# EAGLE design audio_final_final_for_real (EAGLE 5.10)

## Sheet 1 of 3
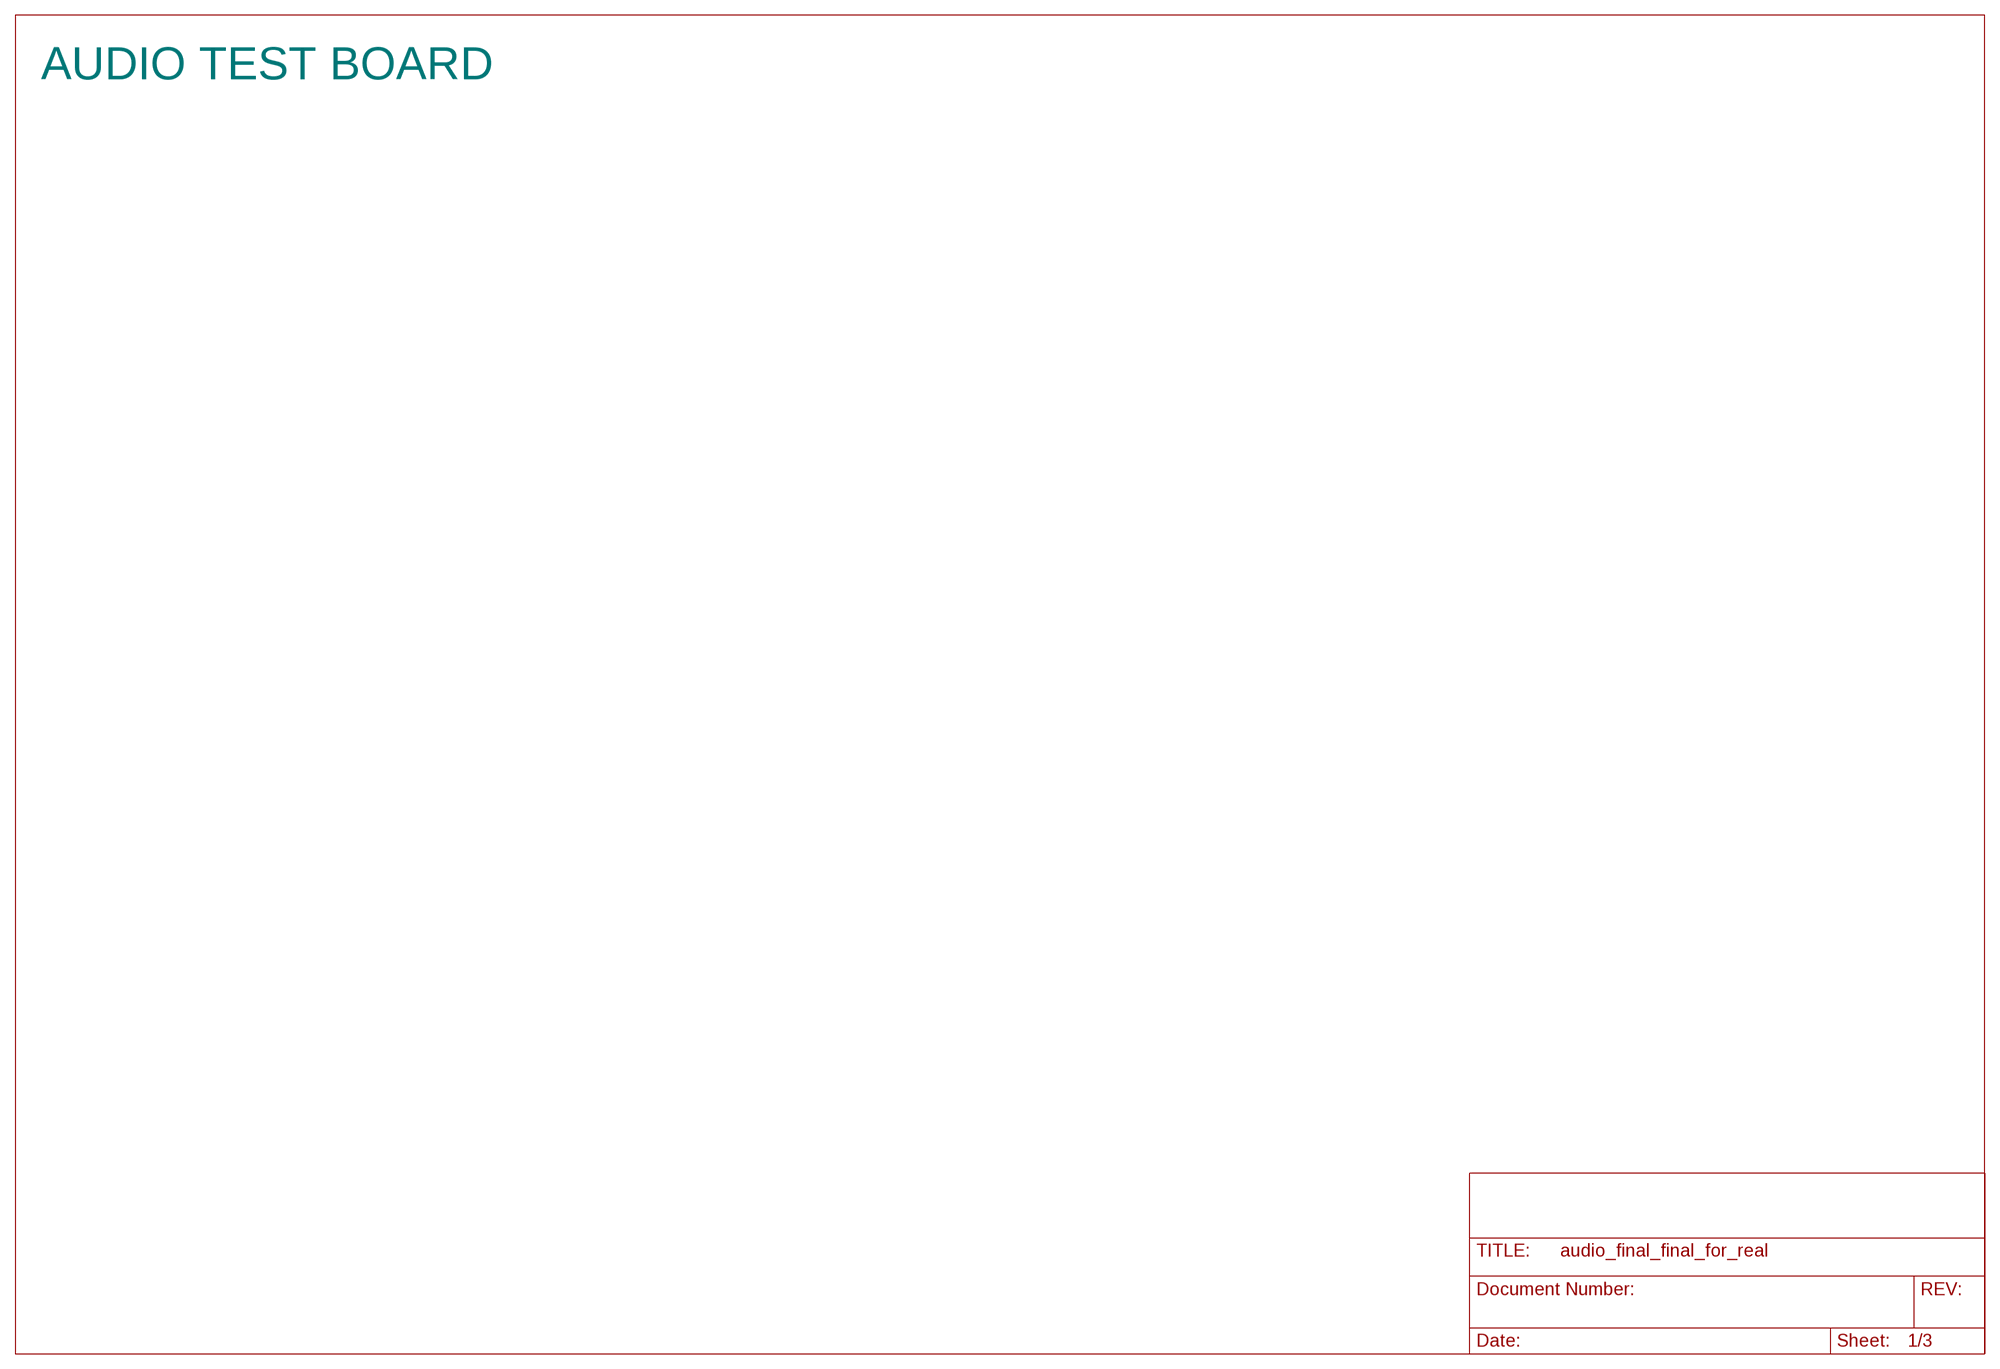
[diagram p0: schematic, sheet 1]

### Notes on the sheet
- AUDIO TEST BOARD

## Sheet 2 of 3
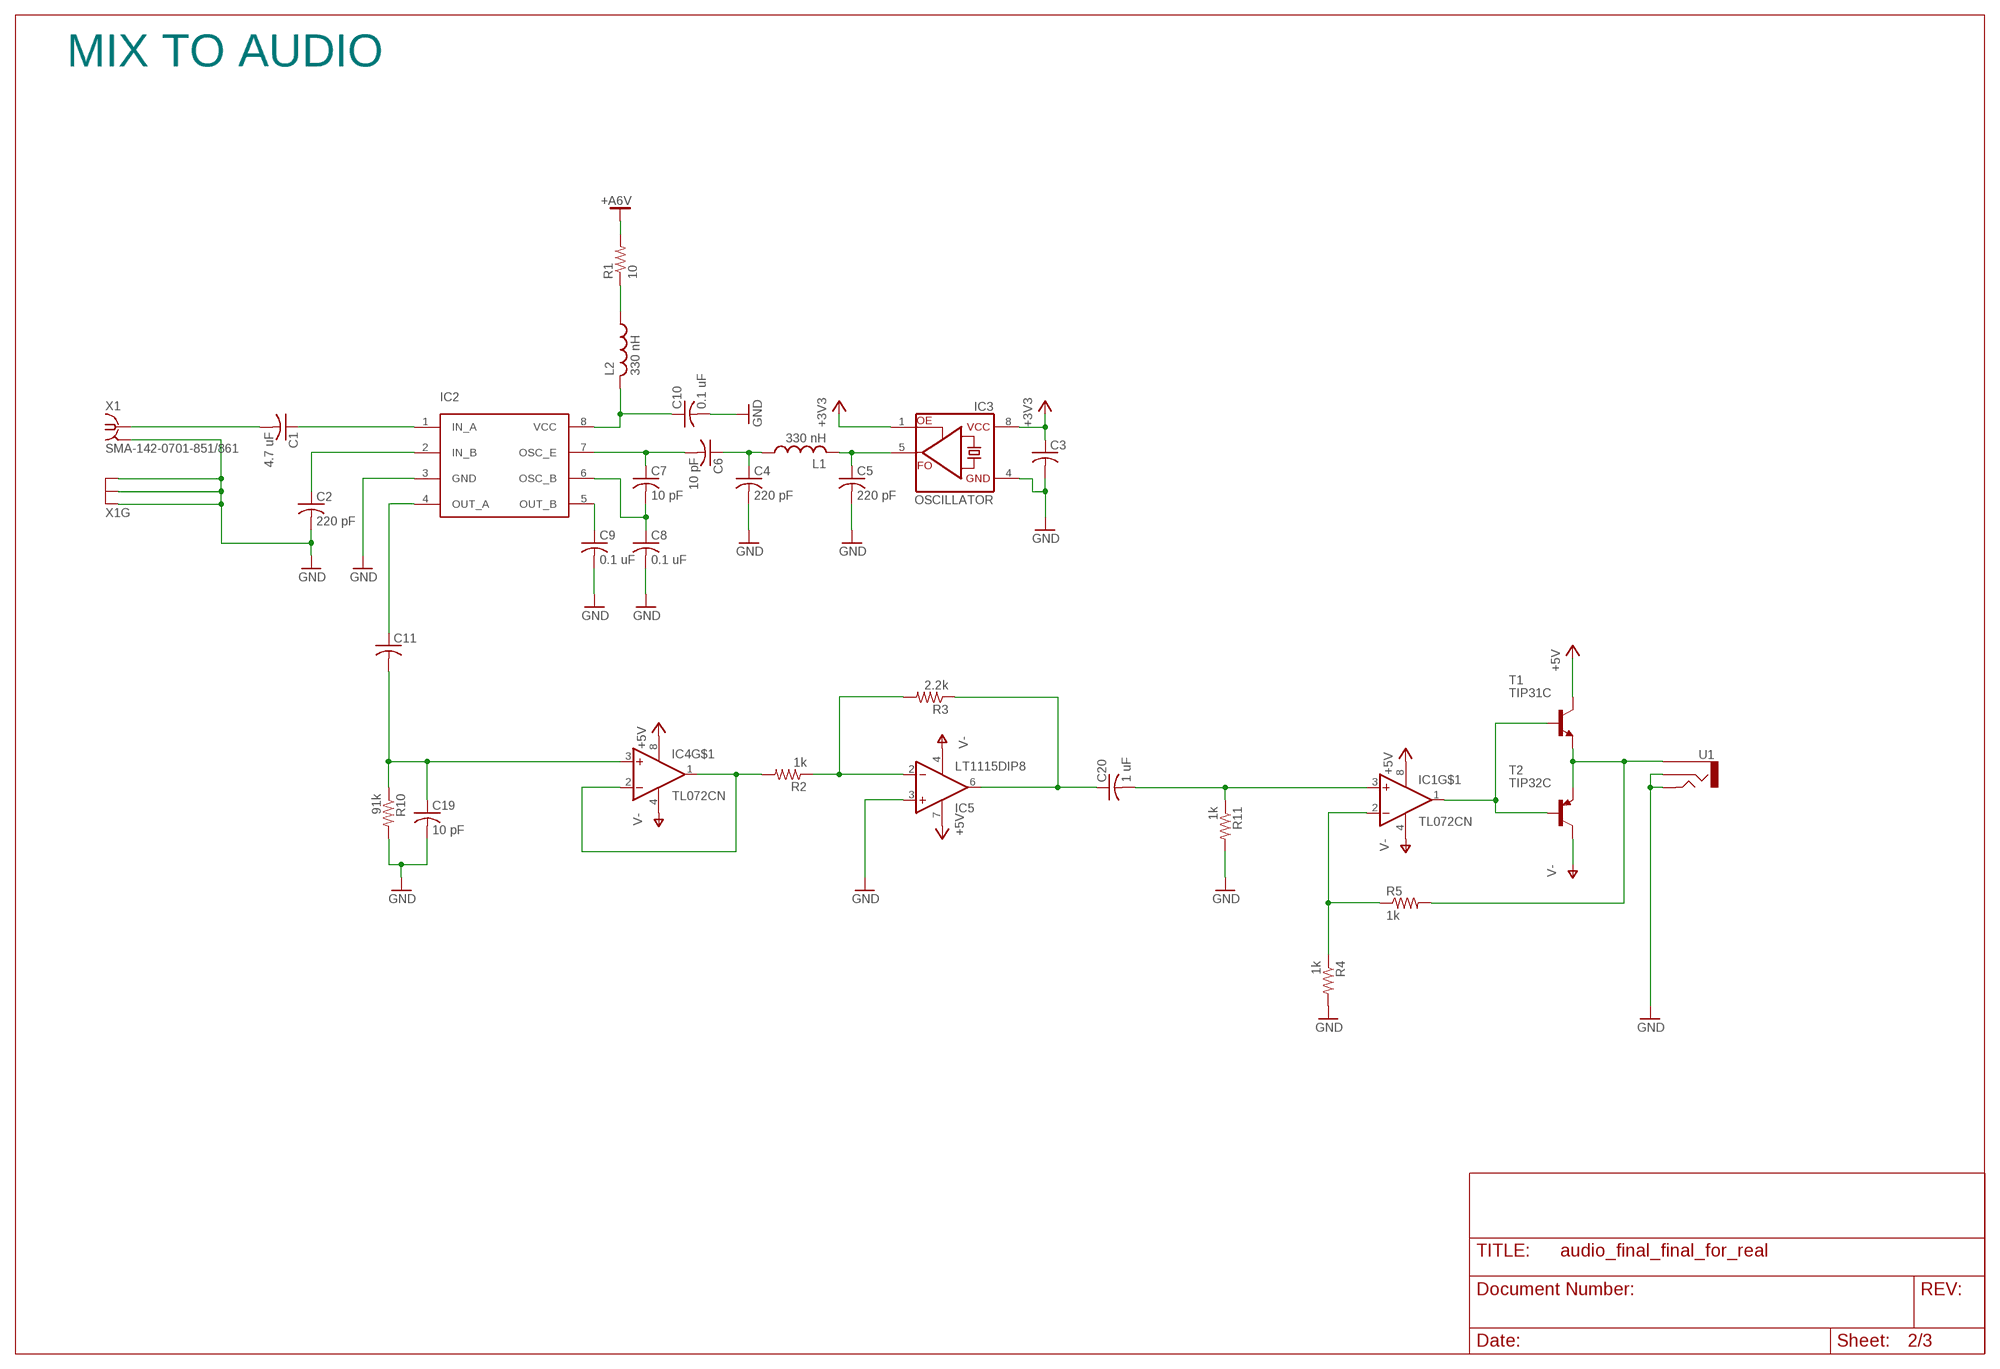
[diagram p1: schematic, sheet 2]

### Parts
C1  4.7 uF  C-US025-025X050  [C025-025X050]
C2  220 pF  C-US025-025X050  [C025-025X050]
C3  C-US025-025X050  [C025-025X050]
C4  220 pF  C-US025-025X050  [C025-025X050]
C5  220 pF  C-US025-025X050  [C025-025X050]
C6  10 pF  C-US025-025X050  [C025-025X050]
C7  10 pF  C-US025-025X050  [C025-025X050]
C8  0.1 uF  C-US025-025X050  [C025-025X050]
C9  0.1 uF  C-US025-025X050  [C025-025X050]
C10  0.1 uF  C-US025-025X050  [C025-025X050]
C11  C-US050-035X075  [C050-035X075]
C19  10 pF  C-US050-025X075  [C050-025X075]
C20  1 uF  C-US025-030X050  [C025-030X050]
IC1  TL072CN  [DIL08]
IC2  SA602DIP8  [DIL08]
IC3  OSCILLATOR  [DIL08]
IC4  TL072CN  [DIL08]
IC5  LT1115DIP8  [DIL08]
L1  330 nH  L-US132-17L  [132-17L]
L2  330 nH  L-US132-17L  [132-17L]
R1  10  R-US_0204/2V  [0204V]
R2  1k  R-US_0204/5  [0204/5]
R3  2.2k  R-US_0204/5  [0204/5]
R4  1k  R-US_0204/2V  [0204V]
R5  1k  R-US_0204/5  [0204/5]
R10  91k  R-US_0204/5  [0204/5]
R11  1k  R-US_0204/2V  [0204V]
T1  TIP31C  [TO220]
T2  TIP32C  [TO220]
U1  AUDIO-JACK2.5MM  [STEREOJACK2.5MM_STEREOJACK2.5MM]
X1  SMA-142-0701-851/861  [J502-ND-142-0701-851/861]

### Nets
+3V3: C3.1 IC3.1(OE) IC3.8(VCC) ; also sheet 3
+5V: IC1.8(V+) IC4.8(V+) IC5.7(V+) T1.2(C) ; also sheet 3
+A6V: R1.2 ; also sheet 3
GND: C2.2 C3.2 C4.2 C5.2 C8.2 C9.2 C10.2 C19.2 IC2.3(GND) IC3.4(GND) IC5.3(+IN) R4.2 R10.2 R11.2 U1.SHIELD U1.TIP X1.G@1(GND) X1.G@2(GND) X1.G@3(GND) X1.G@4(GND) ; also sheet 3
IC4: IC4.1(OUT) IC4.2(-IN) R2.2
N$1: C1.1 IC2.1(IN_A)
N$2: C2.1 IC2.2(IN_B)
N$3: C1.2 X1.1
N$4: C6.2 C7.1 IC2.7(OSC_E)
N$5: C7.2 C8.1 IC2.6(OSC_B)
N$6: C5.1 IC3.5(FO) L1.P$2
N$7: C4.1 C6.1 L1.P$1
N$8: C9.1 IC2.5(OUT_B)
N$9: L2.P$1 R1.1
N$10: C11.2 C19.1 IC4.3(+IN) R10.1
N$11: C10.1 IC2.8(VCC) L2.P$2
N$12: C11.1 IC2.4(OUT_A)
N$13: IC5.2(-IN) R2.1 R3.2
N$15: C20.1 IC5.6(OUT) R3.1
N$16: IC1.1(OUT) T1.1(B) T2.1(B)
N$17: R5.2 T1.3(E) T2.3(E) U1.RING1
N$19: C20.2 IC1.3(+IN) R11.1
N$20: IC1.2(-IN) R4.1 R5.1
V-: IC1.4(GND) IC4.4(GND) IC5.4(GND) T2.2(C) ; also sheet 3
Unconnected: IC1.5(+IN) IC1.6(-IN) IC1.7(OUT) IC4.5(+IN) IC4.6(-IN) IC4.7(OUT)

### Notes on the sheet
- MIX TO AUDIO

## Sheet 3 of 3
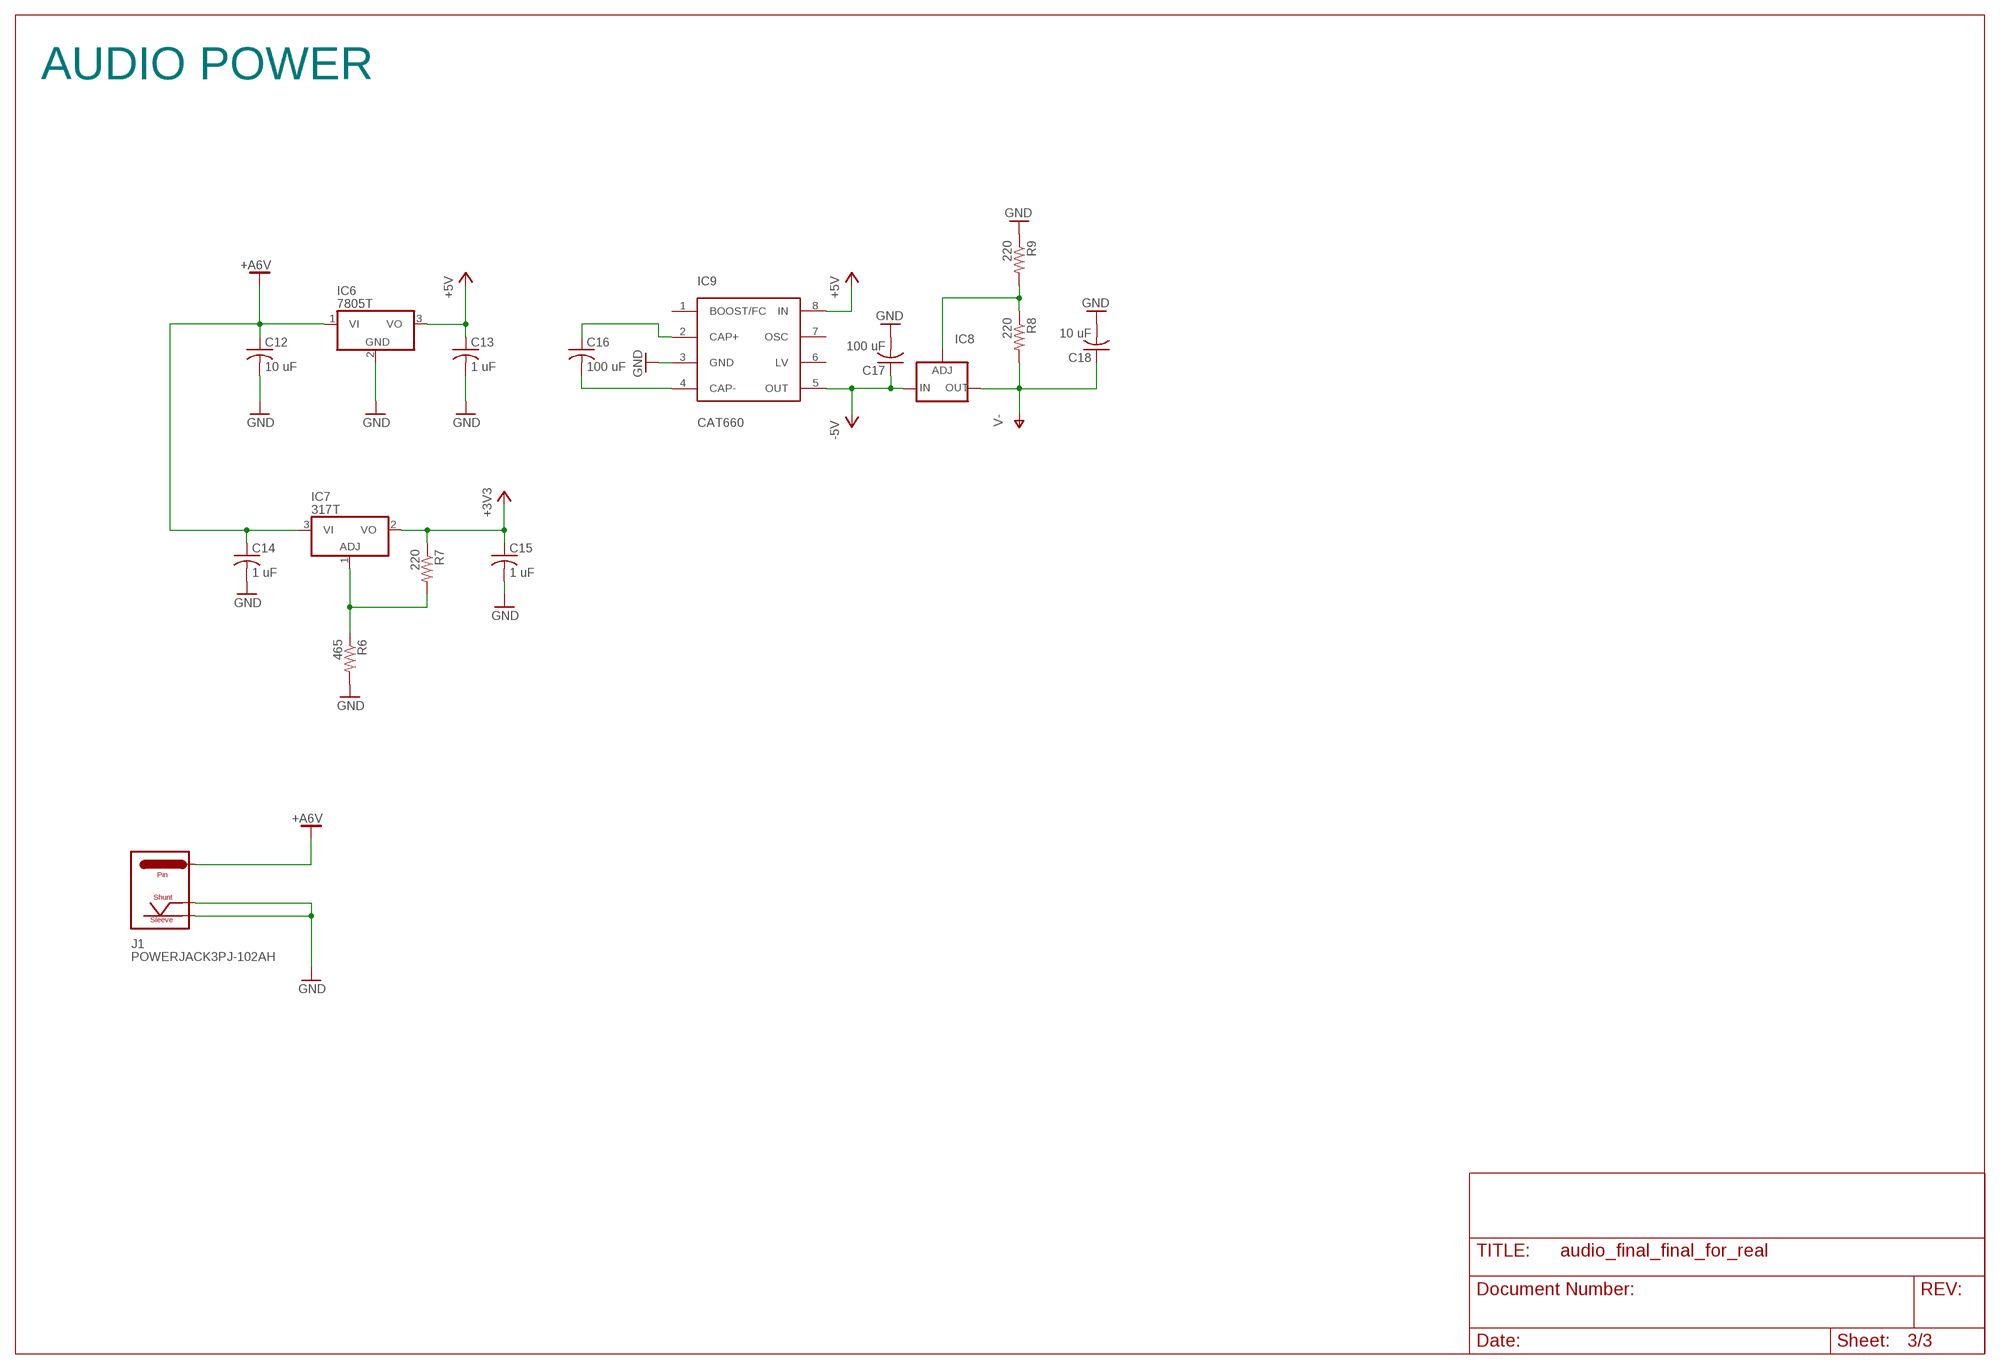
[diagram p2: schematic, sheet 3]

### Parts
C12  10 uF  C-US025-025X050  [C025-025X050]
C13  1 uF  C-US025-025X050  [C025-025X050]
C14  1 uF  C-US025-025X050  [C025-025X050]
C15  1 uF  C-US025-025X050  [C025-025X050]
C16  100 uF  C-US025-025X050  [C025-025X050]
C17  100 uF  C-US025-025X050  [C025-025X050]
C18  10 uF  C-US025-025X050  [C025-025X050]
IC6  7805T  [TO220H]
IC7  317T  [TO220H]
IC8  LM337TL  [337TL]
IC9  CAT660  [DIL08]
J1  POWERJACK3PJ-102AH  [PJ-102AH]
R6  465  R-US_0204/2V  [0204V]
R7  220  R-US_0204/2V  [0204V]
R8  220  R-US_0204/5  [0204/5]
R9  220  R-US_0204/2V  [0204V]

### Nets
+3V3: C15.1 IC7.2(VO) R7.1 ; also sheet 2
+5V: C13.1 IC6.3(VO) IC9.8(IN) ; also sheet 2
+A6V: C12.1 C14.1 IC6.1(VI) IC7.3(VI) J1.CENTER(PIN) ; also sheet 2
-5V: C17.1 IC8.2(IN) IC9.5(OUT)
GND: C12.2 C13.2 C14.2 C15.2 C17.2 C18.2 IC6.2(GND) IC9.3(GND) J1.SLEEVE J1.SWITCH(SHUNT) R6.2 R9.1 ; also sheet 2
N$14: C16.2 IC9.4(CAP-)
N$18: C16.1 IC9.2(CAP+)
N$21: IC7.1(ADJ) R6.1 R7.2
N$22: IC8.1(ADJ) R8.1 R9.2
V-: C18.1 IC8.3(OUT) R8.2 ; also sheet 2
Unconnected: IC9.1(BOOST/FC) IC9.6(LV) IC9.7(OSC)

### Notes on the sheet
- AUDIO POWER

## Library data of the parts
C1-C20 = rcl:C-US: CAPACITOR, American symbol
IC1 IC4 = senior_project_lib:TL072CN
IC2 = senior_project_lib:SA602
IC3 = senior_project_lib:OSCILLATOR
IC5 = senior_project_lib:LT1115
IC6 = linear:78*: Positive VOLTAGE REGULATOR Source: http://cache.national.com/ds/LM/LM78L05.pdf http://www.fairchildsemi.com/ds/LM/LM7805.pdf
IC7 = linear:*317: Positive VOLTAGE REGULATOR
IC8 = v-reg:LM337TL: VOLTAGE REGULATOR
IC9 = senior_project_lib:CAT660
J1 = ads4:POWERJACK3: Pin-Sleeve-Shunt Power Jack
L1 L2 = senior_project_lib:L-US: INDUCTOR, American symbol
R1-R11 = rcl:R-US_: RESISTOR, American symbol
T1 = transistor-neu-to92:TIP31C: NPN TRANSISTOR
T2 = transistor:TIP32: PNP Transistor Medium Power Linear Switching Applications Source: http://onsemi.com
U1 = senior_project_lib:AUDIO-JACK: 3.5mm Audio Jack Simple 3.5mm common PCB mount audio jack. SKU: PRT-08032
X1 = con-coax:SMA-: SMA 50 Ohm End Launch Jack Receptacle - Round Contact Johnson Components Source: www.johnsoncomponents.com .. J502-ND.pdf

## Board
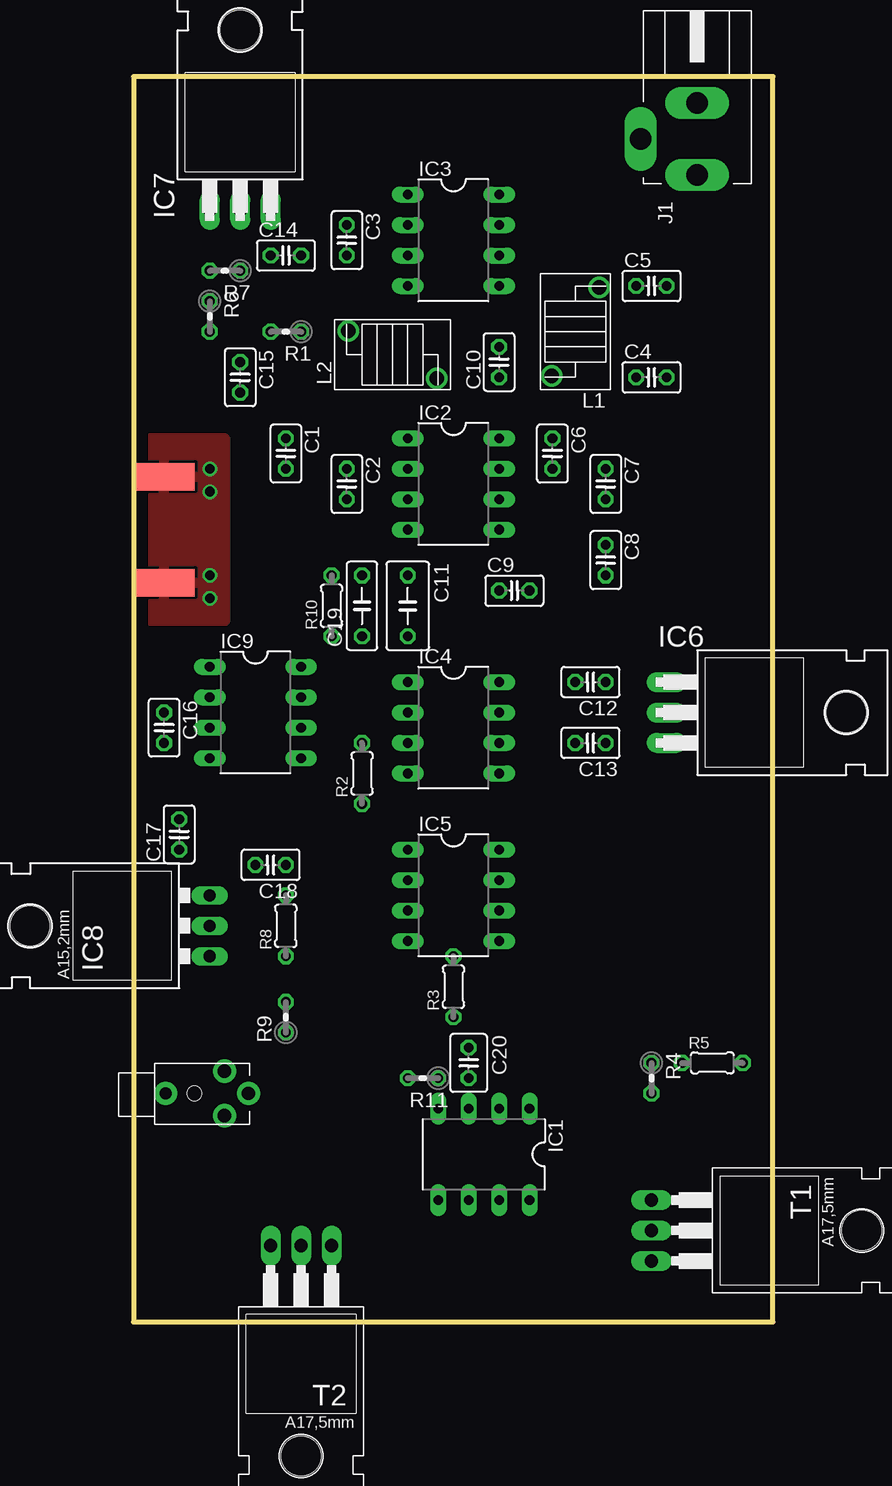
[diagram p3: board, top side]
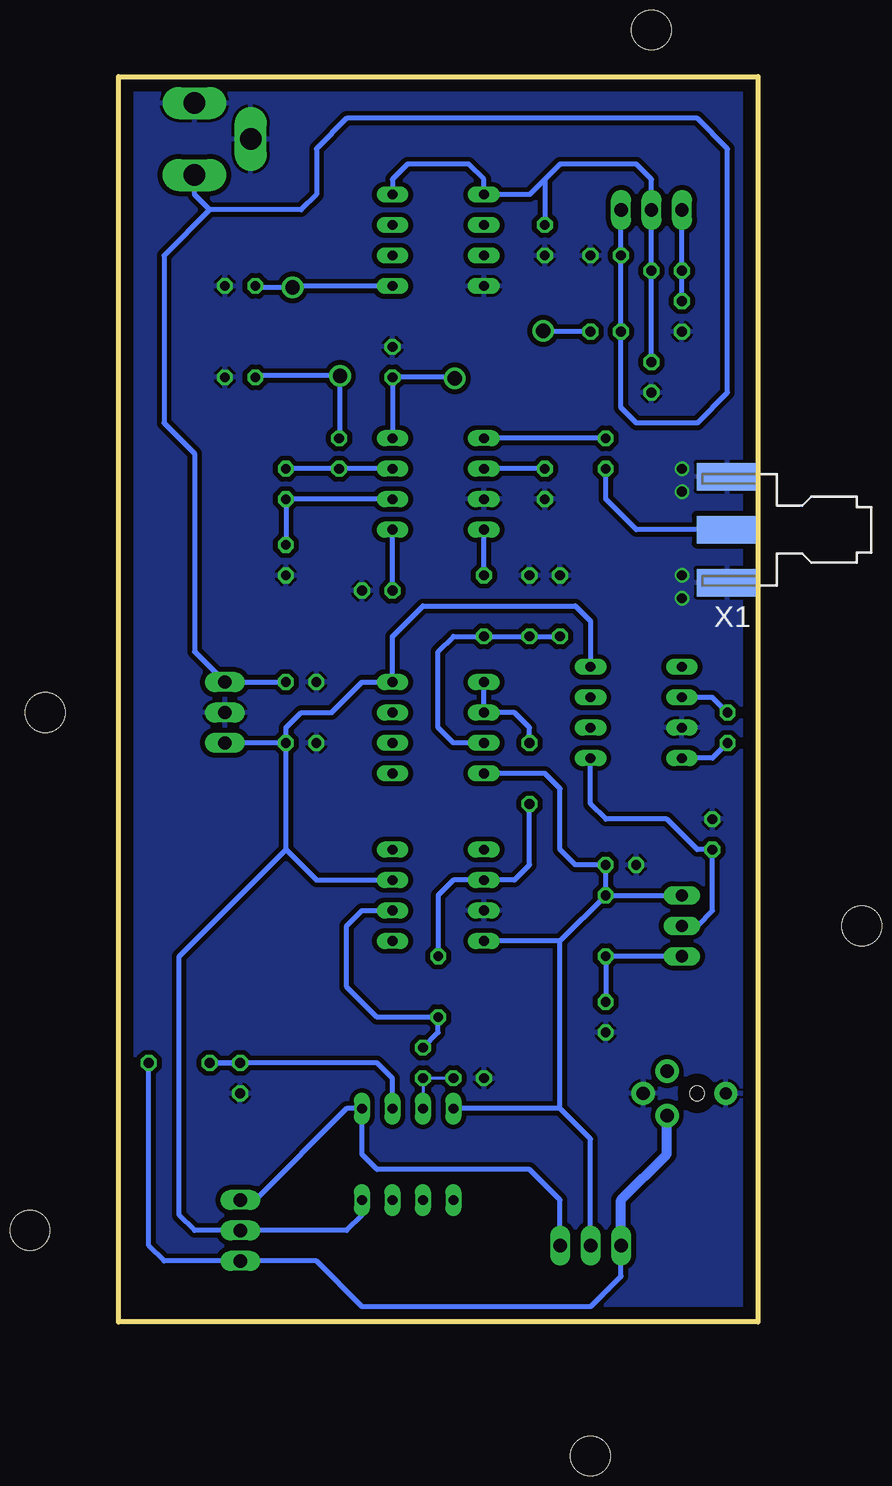
[diagram p4: board, bottom side, seen from below]

Size 53.32 x 103.81 mm. Coordinates in mm from the lower left corner, seen from the top.
Outline: 0,0 53.32,0 53.32,103.81 0,103.81 0,0
Copper layers (1*16): Top 0.035mm / dielectric 1.5mm / Bottom 0.035mm
Design rules "default": minimum track width 10mil, minimum drill 24mil, track to track 8mil, track to pad 8mil, pad to pad 8mil, via to via 8mil, smd to smd 8mil, copper to edge 40mil, drill to drill 8mil, minimum pad ring 10mil, minimum via ring 8mil, stop-mask expansion 4mil, vias tented up to drill 0mil, thermal gap 10mil

### Footprints (pad centres in the part's own frame; a part is rotated, then mirrored left to right if it is on the bottom)
C025-025X050 = drill 0.813 octagon: 1 -1.27,0; 2 1.27,0
C050-035X075 = drill 0.813 octagon: 1 -2.54,0; 2 2.54,0
C050-025X075 = drill 0.813 octagon: 1 -2.54,0; 2 2.54,0
C025-030X050 = drill 0.813 octagon: 1 -1.27,0; 2 1.27,0
DIL08 = drill 0.813 long: 1 -3.81,-3.81; 2 -1.27,-3.81; 3 1.27,-3.81; 4 3.81,-3.81; 5 3.81,3.81; 6 1.27,3.81; 7 -1.27,3.81; 8 -3.81,3.81
TO220H = drill 1.118 long: 1 -2.54,-10.16; 2 0,-10.16; 3 2.54,-10.16 | hole 3.302: 0,4.826
337TL = drill 1.016 long: 1 -2.54,-3.81; 2 0,-3.81; 3 2.54,-3.81 | hole 3.302: 0,11.176
PJ-102AH = drill 1.778 long: CENTER -6,0; SLEEVE 0,0; SWITCH -3,4.7
132-17L = drill 1.2 round: P$1 1.981,3.683; P$2 -1.981,-3.683
0204V = drill 0.813 octagon: 1 -1.27,0; 2 1.27,0
0204/5 = drill 0.813 octagon: 1 -2.54,0; 2 2.54,0
TO220 = drill 1.118 long: 1 -2.54,-6.35; 2 0,-6.35; 3 2.54,-6.35 | hole 3.302: 0,11.176
STEREOJACK2.5MM_STEREOJACK2.5MM = drill 1.1 pad 1.93 round: RING1 2.5,-1.85; RING2 2.5,1.85; TIP 4.5,0 | drill 1 pad 1.93 round: SHIELD -2.4,0 | hole 1.2: 0,0
J502-ND-142-0701-851/861 = smd 5.08 x 2.286: 1 2.565,0; G@1 2.565,4.42; G@2 2.565,-4.42 | smd 5.08 x 2.286 bottom: G@3 2.565,4.42; G@4 2.565,-4.42

### Placement (x,y rotation side)
C1  12.7,72.39 270 top
C2  17.78,69.85 270 top
C3  17.78,90.17 270 top
C4  43.18,78.74 0 top
C5  43.18,86.36 0 top
C6  34.93,72.39 270 top
C7  39.37,69.85 270 top
C8  39.37,63.5 270 top
C9  31.75,60.96 0 top
C10  30.48,80.01 90 top
C11  22.86,59.69 270 top
C12  38.1,53.34 180 top
C13  38.1,48.26 180 top
C14  12.7,88.9 0 top
C15  8.89,78.74 270 top
C16  2.54,49.53 270 top
C17  3.81,40.64 90 top
C18  11.43,38.1 180 top
C19  19.05,59.69 90 top
C20  27.94,21.59 270 top
IC1  29.21,13.97 180 top
IC2  26.67,69.85 270 top
IC3  26.67,90.17 270 top
IC4  26.67,49.53 270 top
IC5  26.67,35.56 270 top
IC6  54.61,50.8 270 top
IC7  8.89,102.87 0 top
IC8  2.54,33.02 90 top
IC9  10.16,50.8 270 top
J1  46.99,101.6 90 top
L1  36.83,82.55 180 top
L2  21.59,80.64 90 top
R1  12.7,82.55 180 top
R2  19.05,45.72 90 top
R3  26.67,27.94 90 top
R4  43.18,20.32 270 top
R5  48.26,21.59 0 top
R6  6.35,83.82 270 top
R7  7.62,87.63 180 top
R8  12.7,33.02 90 top
R9  12.7,25.4 90 top
R10  16.51,59.69 90 top
R11  24.13,20.32 180 top
T1  49.53,7.62 270 top
T2  13.97,0 180 top
U1  5.08,19.05 0 top
X1  0,66.04 180 bottom

### Tracks (layer width: path | path; a pad name or v marks a point on that pad's centre or on a via)
+3V3
  Bottom 0.406: C15.1 R7.1 IC7.2 8.89,95.25 10.16,96.52 16.51,96.52 17.78,95.25 | 17.78,95.25 C3.1 | 17.78,95.25 19.05,93.98 IC3.1 22.86,95.25 24.13,96.52 29.21,96.52 30.48,95.25 IC3.8
+5V
  Bottom 0.406: C13.1 IC6.3 | C13.1 39.37,49.53 38.1,50.8 35.56,50.8 33.02,53.34 IC4.8 30.48,57.15 27.94,59.69 15.24,59.69 13.97,58.42 IC9.8 | IC5.7 36.83,36.83 39.37,39.37 | 39.37,39.37 C13.1 | IC1.8 33.02,8.89 34.29,7.62 T1.2 46.99,7.62 48.26,8.89 48.26,30.48 39.37,39.37
+A6V
  Bottom 0.406: IC7.3 C14.1 R1.2 11.43,76.2 10.16,74.93 5.08,74.93 2.54,77.47 2.54,97.79 5.08,100.33 34.29,100.33 36.83,97.79 36.83,93.98 38.1,92.71 45.72,92.71 | J1.CENTER 46.99,93.98 45.72,92.71 | C12.1 IC6.1 46.99,55.88 46.99,72.39 49.53,74.93 49.53,88.9 45.72,92.71
-5V
  Bottom 0.406: IC8.2 5.08,33.02 3.81,34.29 C17.1 5.08,39.37 7.62,41.91 12.7,41.91 13.97,43.18 IC9.5
GND  (via drill 0.8)
  other vias: 6.35,62.23 6.35,60.33 6.35,69.22 6.35,71.12
  pour Bottom (isolate 0.406): 0,105.41 66.04,105.41 66.04,-1.27 0,-1.27
  pour Top: 0,73.66 7.62,73.66 7.62,58.42 0,58.42
IC4
  Bottom 0.406: IC4.1 IC4.2 20.32,50.8 19.05,49.53 R2.2
N$1
  Bottom 0.406: C1.1 IC2.1
N$2
  Bottom 0.406: C2.1 IC2.2
N$3
  Bottom 0.406: X1.1 10.16,66.04 12.7,68.58 C1.2
N$4
  Bottom 0.406: IC2.7 C6.2 C7.1
N$5
  Bottom 0.406: IC2.6 C7.2 C8.1
N$6
  Bottom 0.406: IC3.5 38.68,86.36 L1.P$2 41.78,86.23 C5.1
N$7
  Bottom 0.406: C4.1 41.78,78.87 L1.P$1 34.85,73.74 C6.1
N$8
  Bottom 0.406: C9.1 IC2.5
N$9
  Bottom 0.406: R1.1 17.83,82.55 L2.P$1
N$10
  Bottom 0.406: R10.1 C19.1 C11.2 25.4,57.15 26.67,55.88 26.67,49.53 25.4,48.26 IC4.3
N$11
  Bottom 0.406: L2.P$2 25.35,78.74 C10.1 IC2.8
N$12
  Bottom 0.406: C11.1 IC2.4
N$13
  Bottom 0.406: R2.1 19.05,38.1 20.32,36.83 IC5.2 25.4,36.83 26.67,35.56 R3.2
N$14
  Bottom 0.406: IC9.4 3.81,46.99 C16.2
N$15
  Bottom 0.406: IC5.6 33.02,34.29 34.29,33.02 34.29,27.94 31.75,25.4 R3.1 26.67,24.13 C20.1
N$16
  Bottom 0.406: T2.1 16.51,10.16 19.05,12.7 31.75,12.7 33.02,13.97 IC1.1 34.29,17.78 41.91,10.16 T1.1
N$17
  Bottom 0.406: T2.3 11.43,3.81 13.97,1.27 33.02,1.27 36.83,5.08 T1.3 49.53,5.08 50.8,6.35 R5.2
  Bottom 0.813: T2.3 11.43,10.16 7.62,13.97 7.62,17.16 U1.RING1
N$18
  Bottom 0.406: IC9.2 3.81,52.07 C16.1
N$19
  Bottom 0.254: IC1.3 C20.2 R11.1
N$20
  Bottom 0.406: IC1.2 30.48,20.32 31.75,21.59 R5.1 R4.1
N$21
  Bottom 0.406: IC7.1 R7.2 R6.1
N$22
  Bottom 0.406: IC8.1 R8.1 R9.2
V-
  Bottom 0.406: R8.2 IC8.3 | R8.2 C18.1 15.24,38.1 16.51,39.37 16.51,44.45 17.78,45.72 IC4.4 | T2.2 13.97,15.24 16.51,17.78 | 16.51,17.78 IC1.4 | 16.51,31.75 IC5.4 | 16.51,31.75 R8.2 | 16.51,17.78 16.51,31.75